# EAGLE board ME461_F28379D (EAGLE 7.7.0), part 1 of 3
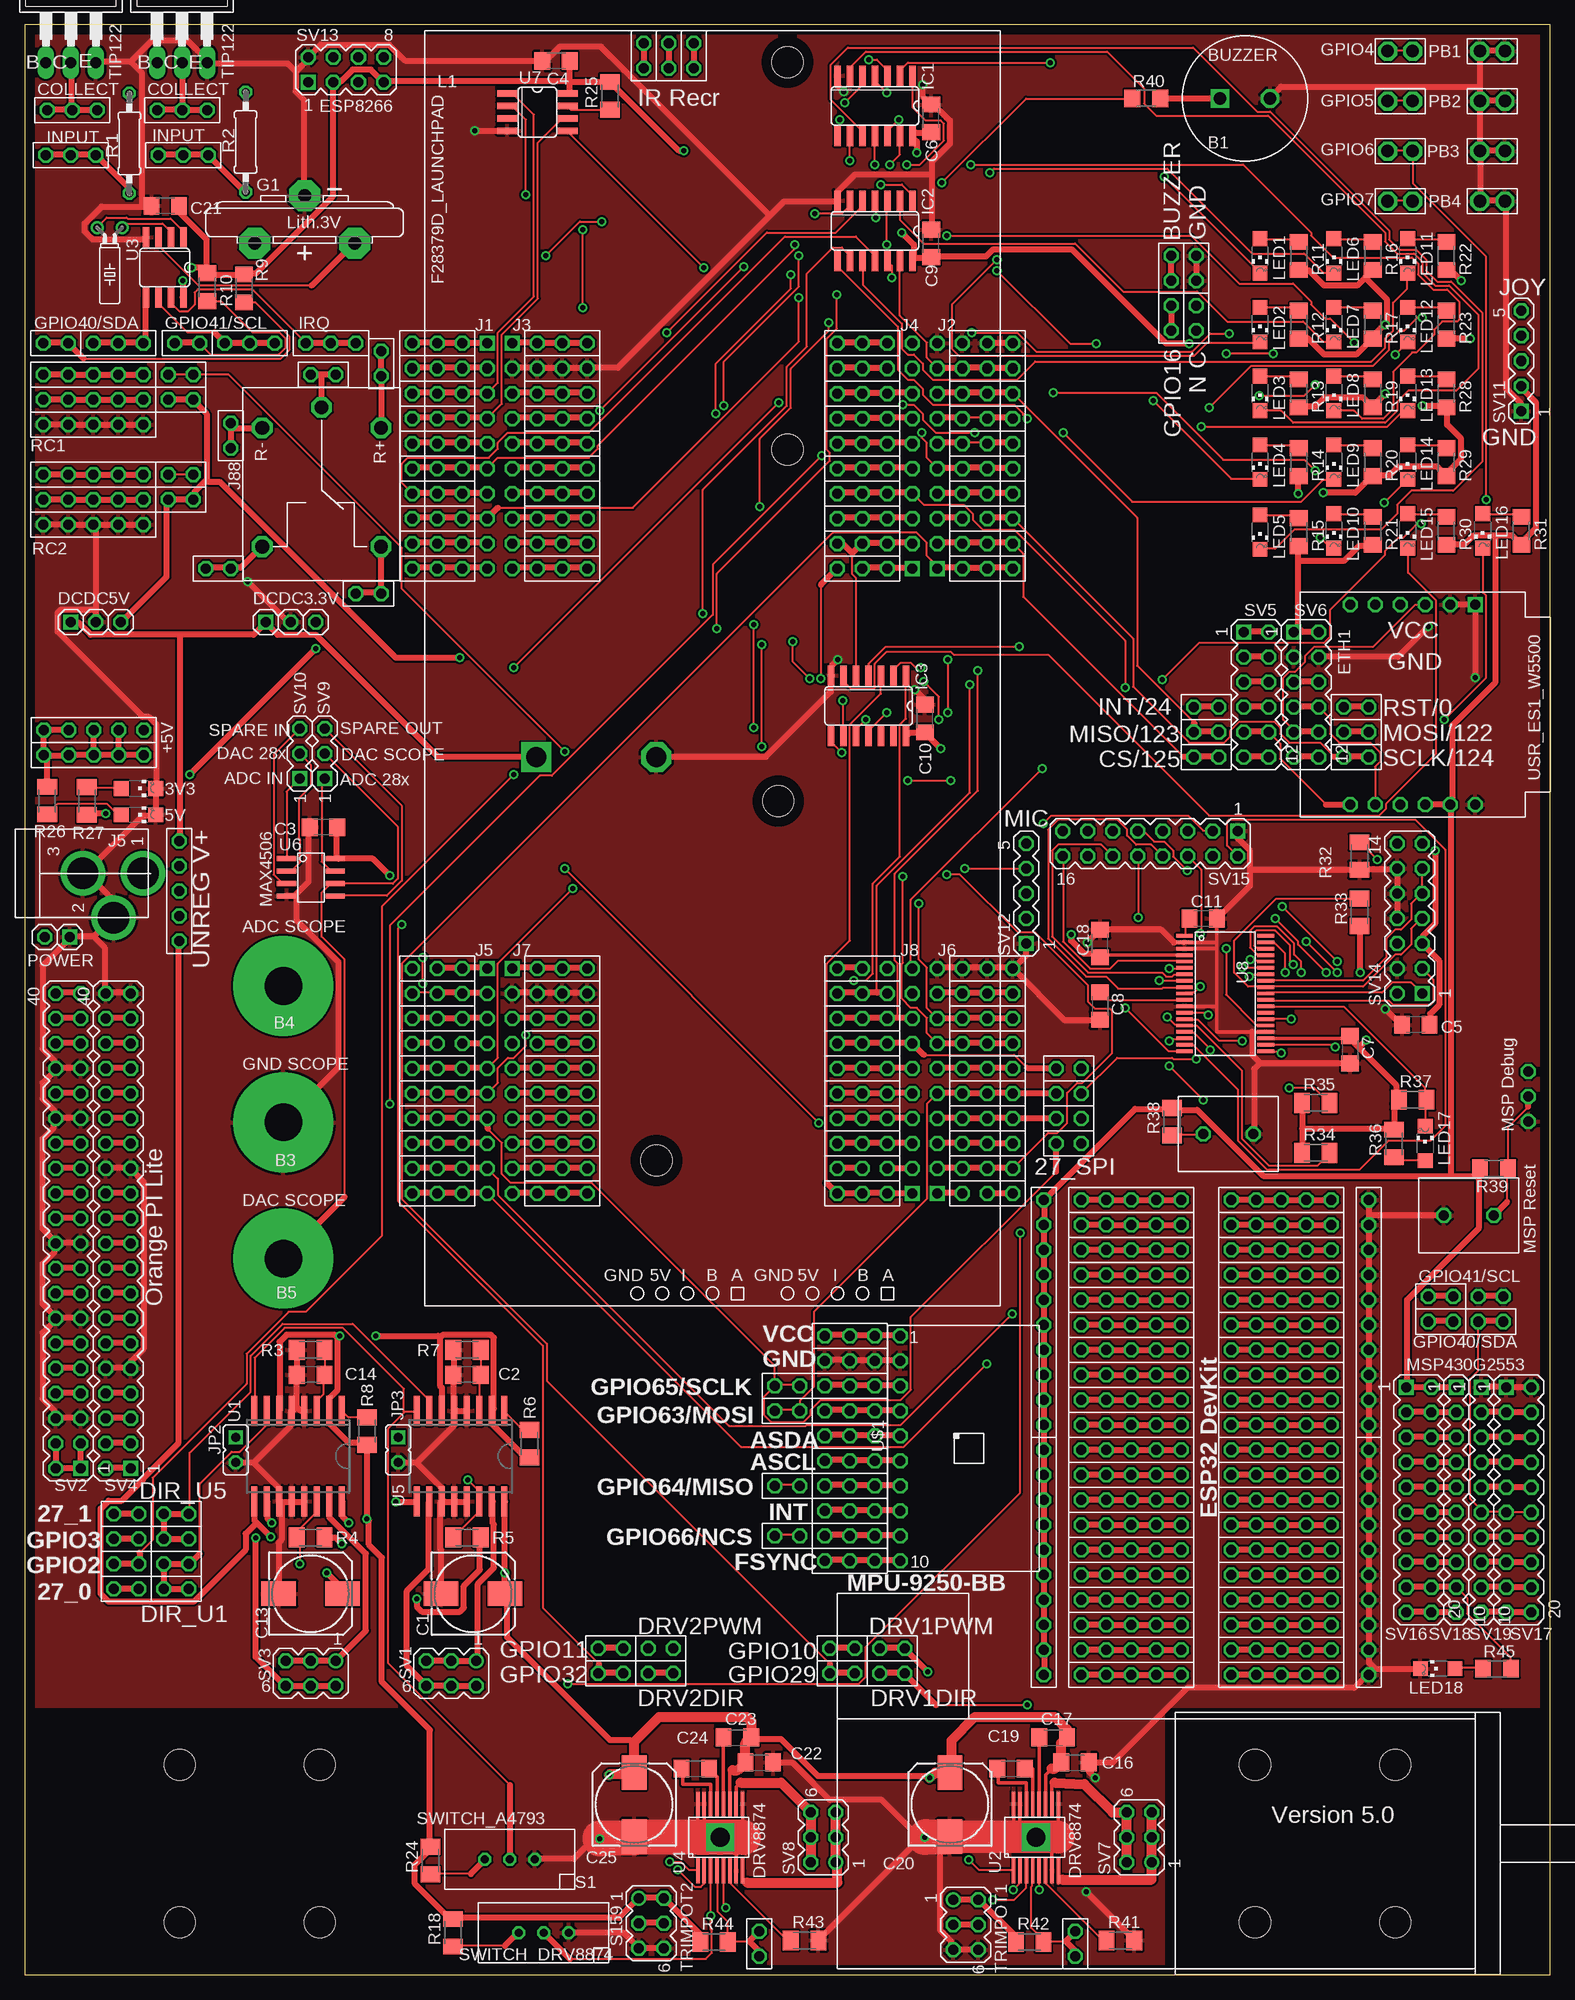
[diagram p5: board, top side]
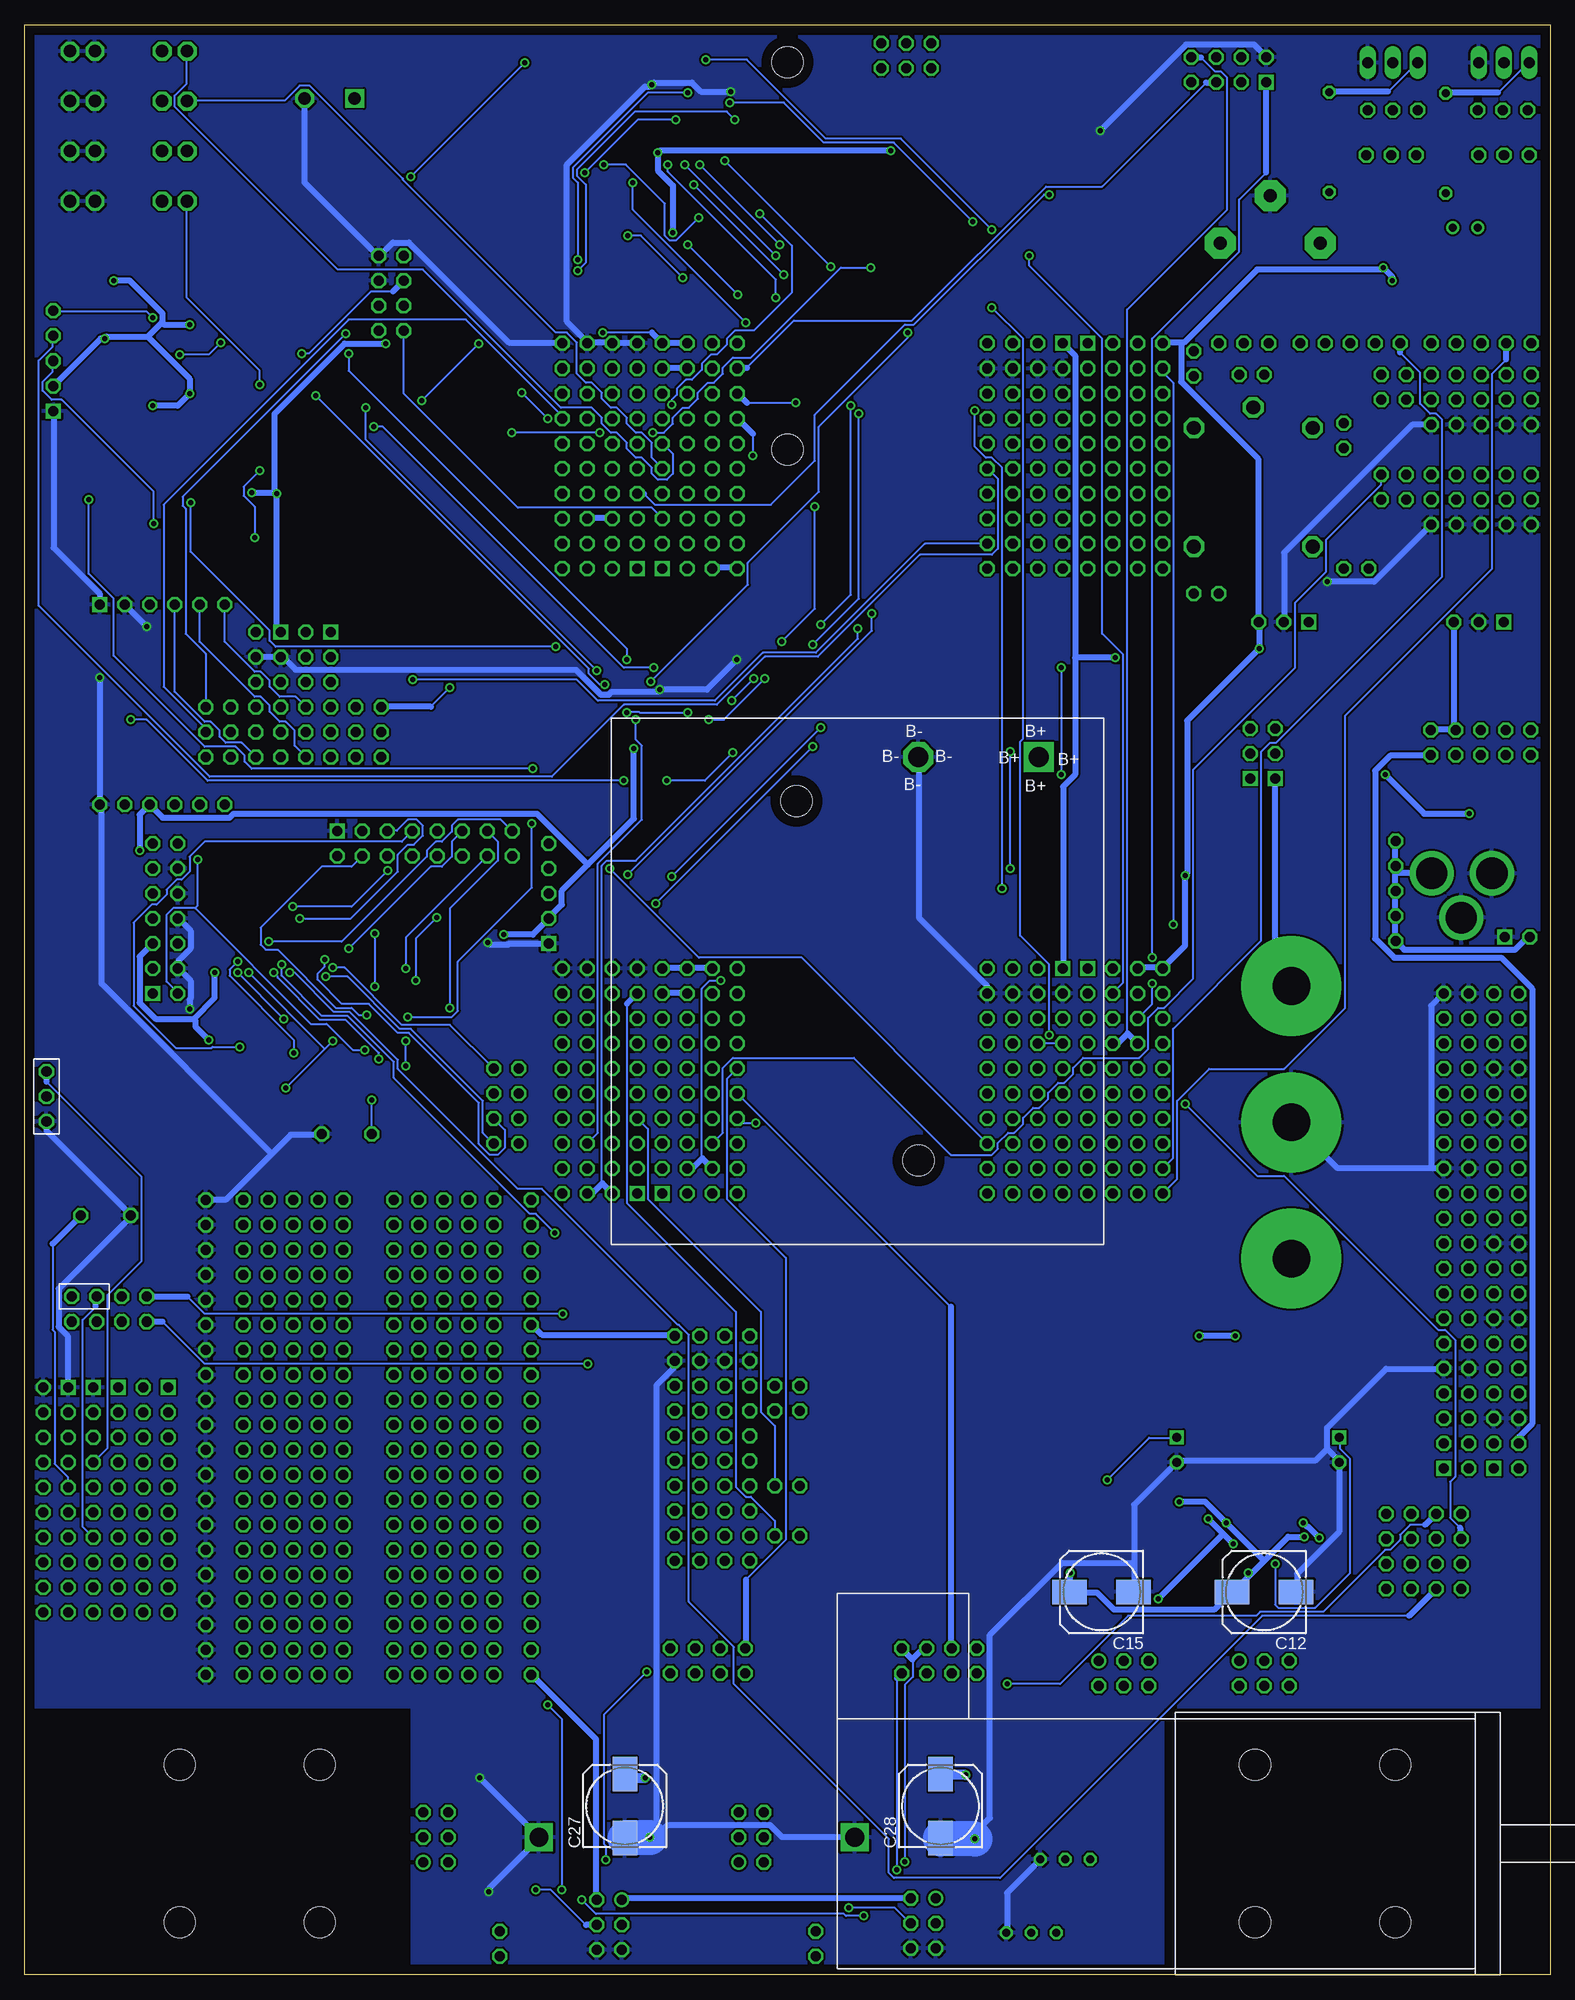
[diagram p6: board, bottom side, seen from below]

Size 154.94 x 198.12 mm. Coordinates in mm from the lower left corner, seen from the top.
Outline: 0,0 154.94,0 154.94,198.12 0,198.12 0,0
Copper layers (1*16): Top 0.035mm / dielectric 1.5mm / Bottom 0.035mm
Design rules "default *": minimum track width 7mil, minimum drill 20mil, track to track 8mil, track to pad 8mil, pad to pad 8mil, via to via 8mil, smd to smd 8mil, copper to edge 40mil, drill to drill 8mil, minimum pad ring 10mil, minimum via ring 8mil, stop-mask expansion 4mil, vias tented up to drill 20mil, thermal gap 10mil
Net classes: 0 default: width 0.203 mm, drill 0.508 mm, clearance 0.203 mm; 1 supply: width 0.61 mm, drill 0.508 mm, clearance 0.203 mm
tRestrict: area 0,0 to 38.7,26.7; area 116.2,0 to 154.9,26.7
bRestrict: area 116.2,0 to 154.9,26.7; area 0,0 to 38.7,26.7

## Footprints (pad centres in the part's own frame; a part is rotated, then mirrored left to right if it is on the bottom)
CHIPLED_1206 = smd 1.5 x 1.5: A 0,-1.75; C 0,1.75
BUZZER = drill 1.27 square: P$1 -2.54,0 | drill 1.27 octagon: P$2 2.54,0
BATTERY_4AA_HOLDER = drill 2.032 square: P$1 0,0 | drill 2.032 octagon: P$2 12.224,0 | hole 3.175: 12.224,40.958; 24.606,4.445
BANANA_MALE = drill 3.81 pad 10.16: P$1 0,0
153CLV-0810 = smd 3.5 x 2.5: + 3.25,0; - -3.25,0
C1206 = smd 1.6 x 1.8: 1 -1.4,0; 2 1.4,0
1X03 = drill 1.016 square: 1 -2.54,0 | drill 1.016 octagon: 2 0,0; 3 2.54,0
USR_ES1_W5500 = drill 1.016 square: P$1 0,0 | drill 1.016 octagon: P$2 0,-2.54; P$3 0,-5.08; P$4 0,-7.62; P$5 0,-10.16; P$6 0,-12.7; P$7 20.32,-12.7; P$8 20.32,-10.16; P$9 20.32,-7.62; P$10 20.32,-5.08; P$11 20.32,-2.54; P$12 20.32,0
CR2032V = drill 1.321 pad 3.15 octagon: + -2.54,-5.08; +@1 -2.54,5.08; - 2.286,0
SO14 = smd 0.66 x 2.032: 1 -3.81,-3.073; 2 -2.54,-3.073; 3 -1.27,-3.073; 4 0,-3.073; 5 1.27,-3.073; 6 2.54,-3.073; 7 3.81,-3.073; 8 3.81,3.073; 9 2.54,3.073; 10 1.27,3.073; 11 0,3.073; 12 -1.27,3.073; 13 -2.54,3.073; 14 -3.81,3.073
STRIP3 = drill 1.016 octagon: P$1 0,0; P$2 2.54,0; P$3 5.08,0
JACK-PMS = drill 3.175 pad 4.5: 1 -0.5,-3.31; 2 -5,-0.31; 3 -0.5,2.809
STRIP2 = drill 1.016 octagon: P$1 0,0; P$2 2.54,0
RELAY_JQC-3F_5V = drill 1.397 octagon: P$1 0,0; P$2 2.064,6.032; P$3 14.129,6.032; P$4 14.129,-6.032; P$5 2.064,-6.032
JP1 = drill 0.914 square: 1 0,-1.27 | drill 0.914 octagon: 2 0,1.27
F28379D_LAUNCHPAD = drill 1.016 square: P$1 -24.13,33.02; P$11 21.59,10.16; P$21 -21.59,33.02; P$31 19.05,10.16; P$41 -24.13,-30.48; P$51 21.59,-53.34; P$61 -21.59,-30.48; P$71 19.05,-53.34 | drill 1.016 octagon: P$2 -24.13,30.48; P$3 -24.13,27.94; P$4 -24.13,25.4; P$5 -24.13,22.86; P$6 -24.13,20.32; P$7 -24.13,17.78; P$8 -24.13,15.24; P$9 -24.13,12.7; P$10 -24.13,10.16; P$12 21.59,12.7; P$13 21.59,15.24; P$14 21.59,17.78; P$15 21.59,20.32; P$16 21.59,22.86; P$17 21.59,25.4; P$18 21.59,27.94; P$19 21.59,30.48; P$20 21.59,33.02; P$22 -21.59,30.48; P$23 -21.59,27.94; P$24 -21.59,25.4; P$25 -21.59,22.86; P$26 -21.59,20.32; P$27 -21.59,17.78; P$28 -21.59,15.24; P$29 -21.59,12.7; P$30 -21.59,10.16; P$32 19.05,12.7; P$33 19.05,15.24; P$34 19.05,17.78; P$35 19.05,20.32; P$36 19.05,22.86; P$37 19.05,25.4; P$38 19.05,27.94; P$39 19.05,30.48; P$40 19.05,33.02; P$42 -24.13,-33.02; P$43 -24.13,-35.56; P$44 -24.13,-38.1; P$45 -24.13,-40.64; P$46 -24.13,-43.18; P$47 -24.13,-45.72; P$48 -24.13,-48.26; P$49 -24.13,-50.8; P$50 -24.13,-53.34; P$52 21.59,-50.8; P$53 21.59,-48.26; P$54 21.59,-45.72; P$55 21.59,-43.18; P$56 21.59,-40.64; P$57 21.59,-38.1; P$58 21.59,-35.56; P$59 21.59,-33.02; P$60 21.59,-30.48; P$62 -21.59,-33.02; P$63 -21.59,-35.56; P$64 -21.59,-38.1; P$65 -21.59,-40.64; P$66 -21.59,-43.18; P$67 -21.59,-45.72; P$68 -21.59,-48.26; P$69 -21.59,-50.8; P$70 -21.59,-53.34; P$72 19.05,-50.8; P$73 19.05,-48.26; P$74 19.05,-45.72; P$75 19.05,-43.18; P$76 19.05,-40.64; P$77 19.05,-38.1; P$78 19.05,-35.56; P$79 19.05,-33.02; P$80 19.05,-30.48
TH_PUSHBUTTON = drill 1.016 octagon: 1 0,2.54; 2 0,-2.54
1X02 = drill 1.016 square: 1 -1.27,0 | drill 1.016 octagon: 2 1.27,0
TC26H = drill 0.813: 1 -1.27,0; 2 1.27,0
0207/10 = drill 0.813 octagon: 1 -5.08,0; 2 5.08,0
M1206 = smd 1.6 x 2: 1 -1.4,0; 2 1.4,0
R1206 = smd 1.6 x 1.803: 1 -1.422,0; 2 1.422,0
SWITCH_SLIDE = drill 0.813 octagon: P$1 0,-5.08; P$2 0,-2.54; P$3 0,0
STRIP5 = drill 1.016 octagon: P$1 0,0; P$2 2.54,0; P$3 5.08,0; P$4 7.62,0; P$5 10.16,0
STRIP10 = drill 1.016 octagon: P$1 0,0; P$2 2.54,0; P$3 5.08,0; P$4 7.62,0; P$5 10.16,0; P$6 12.7,0; P$7 15.24,0; P$8 17.78,0; P$9 20.32,0; P$10 22.86,0
MA03-2 = drill 1.016: 1 -2.54,-1.27 | drill 1.016 octagon: 2 -2.54,1.27; 3 0,-1.27; 4 0,1.27; 5 2.54,-1.27; 6 2.54,1.27
MA20-2 = drill 1.016 square: 1 -24.13,-1.27 | drill 1.016 octagon: 2 -24.13,1.27; 3 -21.59,-1.27; 4 -21.59,1.27; 5 -19.05,-1.27; 6 -19.05,1.27; 7 -16.51,-1.27; 8 -16.51,1.27; 9 -13.97,-1.27; 10 -13.97,1.27; 11 -11.43,-1.27; 12 -11.43,1.27; 13 -8.89,-1.27; 14 -8.89,1.27; 15 -6.35,-1.27; 16 -6.35,1.27; 17 -3.81,-1.27; 18 -3.81,1.27; 19 -1.27,-1.27; 20 -1.27,1.27; 21 1.27,-1.27; 22 1.27,1.27; 23 3.81,-1.27; 24 3.81,1.27; 25 6.35,-1.27; 26 6.35,1.27; 27 8.89,-1.27; 28 8.89,1.27; 29 11.43,-1.27; 30 11.43,1.27; 31 13.97,-1.27; 32 13.97,1.27; 33 16.51,-1.27; 34 16.51,1.27; 35 19.05,-1.27; 36 19.05,1.27; 37 21.59,-1.27; 38 21.59,1.27; 39 24.13,-1.27; 40 24.13,1.27
MA06-2 = drill 1.016 square: 1 -6.35,-1.27 | drill 1.016 octagon: 2 -6.35,1.27; 3 -3.81,-1.27; 4 -3.81,1.27; 5 -1.27,-1.27; 6 -1.27,1.27; 7 1.27,-1.27; 8 1.27,1.27; 9 3.81,-1.27; 10 3.81,1.27; 11 6.35,-1.27; 12 6.35,1.27
MA03-1 = drill 1.016 square: 1 -2.54,0 | drill 1.016 octagon: 2 0,0; 3 2.54,0
MA05-1 = drill 1.016 square: 1 -5.08,0 | drill 1.016 octagon: 2 -2.54,0; 3 0,0; 4 2.54,0; 5 5.08,0
MA04-2 = drill 1.016 square: 1 -3.81,-1.27 | drill 1.016 octagon: 2 -3.81,1.27; 3 -1.27,-1.27; 4 -1.27,1.27; 5 1.27,-1.27; 6 1.27,1.27; 7 3.81,-1.27; 8 3.81,1.27
MA07-2 = drill 1.016 square: 1 -7.62,-1.27 | drill 1.016 octagon: 2 -7.62,1.27; 3 -5.08,-1.27; 4 -5.08,1.27; 5 -2.54,-1.27; 6 -2.54,1.27; 7 0,-1.27; 8 0,1.27; 9 2.54,-1.27; 10 2.54,1.27; 11 5.08,-1.27; 12 5.08,1.27; 13 7.62,-1.27; 14 7.62,1.27
MA08-2 = drill 1.016 square: 1 -8.89,-1.27 | drill 1.016 octagon: 2 -8.89,1.27; 3 -6.35,-1.27; 4 -6.35,1.27; 5 -3.81,-1.27; 6 -3.81,1.27; 7 -1.27,-1.27; 8 -1.27,1.27; 9 1.27,-1.27; 10 1.27,1.27; 11 3.81,-1.27; 12 3.81,1.27; 13 6.35,-1.27; 14 6.35,1.27; 15 8.89,-1.27; 16 8.89,1.27
MA10-2 = drill 1.016 square: 1 -11.43,-1.27 | drill 1.016 octagon: 2 -11.43,1.27; 3 -8.89,-1.27; 4 -8.89,1.27; 5 -6.35,-1.27; 6 -6.35,1.27; 7 -3.81,-1.27; 8 -3.81,1.27; 9 -1.27,-1.27; 10 -1.27,1.27; 11 1.27,-1.27; 12 1.27,1.27; 13 3.81,-1.27; 14 3.81,1.27; 15 6.35,-1.27; 16 6.35,1.27; 17 8.89,-1.27; 18 8.89,1.27; 19 11.43,-1.27; 20 11.43,1.27
MA10-1 = drill 1.016 square: 1 -11.43,0 | drill 1.016 octagon: 2 -8.89,0; 3 -6.35,0; 4 -3.81,0; 5 -1.27,0; 6 1.27,0; 7 3.81,0; 8 6.35,0; 9 8.89,0; 10 11.43,0
TO220 = drill 1.118 long: 1 -2.54,-6.35; 2 0,-6.35; 3 2.54,-6.35
SO16W_LONGERPINS = smd 0.6 x 3.048: 1 -4.445,-4.6; 2 -3.175,-4.6; 3 -1.905,-4.6; 4 -0.635,-4.6; 5 0.635,-4.6; 6 1.905,-4.6; 7 3.175,-4.6; 8 4.445,-4.6; 9 4.445,4.6; 10 3.175,4.6; 11 1.905,4.6; 12 0.635,4.6; 13 -0.635,4.6; 14 -1.905,4.6; 15 -3.175,4.6; 16 -4.445,4.6
HTSSOP16 = smd 2.5 x 0.35: P$1 -3.4,2.275; P$2 -3.4,1.625; P$3 -3.4,0.975; P$4 -3.4,0.325; P$5 -3.4,-0.325; P$6 -3.4,-0.975; P$7 -3.4,-1.625; P$8 -3.4,-2.275; P$9 3.4,-2.275; P$10 3.4,-1.625; P$11 3.4,-0.975; P$12 3.4,-0.325; P$13 3.4,0.325; P$14 3.4,0.975; P$15 3.4,1.625; P$16 3.4,2.275 | drill 1.905 pad 2.54 square: P$17 0,0
SO08 = smd 0.66 x 2.032: 1 -1.905,-3.073; 2 -0.635,-3.073; 3 0.635,-3.073; 4 1.905,-3.073; 5 1.905,3.073; 6 0.635,3.073; 7 -0.635,3.073; 8 -1.905,3.073
SOIC-8 = smd 1.98 x 0.53: P$1 -2.465,1.905; P$2 -2.465,0.635; P$3 -2.465,-0.635; P$4 -2.465,-1.905; P$5 2.465,-1.905; P$6 2.465,-0.635; P$7 2.465,0.635; P$8 2.465,1.905
DA38 = smd 0.35 x 1.705: 1 -5.85,-4.12; 2 -5.2,-4.12; 3 -4.55,-4.12; 4 -3.9,-4.12; 5 -3.25,-4.12; 6 -2.6,-4.12; 7 -1.95,-4.12; 8 -1.3,-4.12; 9 -0.65,-4.12; 10 0,-4.12; 11 0.65,-4.12; 12 1.3,-4.12; 13 1.95,-4.12; 14 2.6,-4.12; 15 3.25,-4.12; 16 3.9,-4.12; 17 4.55,-4.12; 18 5.2,-4.12; 19 5.85,-4.12; 20 5.85,4.12; 21 5.2,4.12; 22 4.55,4.12; 23 3.9,4.12; 24 3.25,4.12; 25 2.6,4.12; 26 1.95,4.12; 27 1.3,4.12; 28 0.65,4.12; 29 0,4.12; 30 -0.65,4.12; 31 -1.3,4.12; 32 -1.95,4.12; 33 -2.6,4.12; 34 -3.25,4.12; 35 -3.9,4.12; 36 -4.55,4.12; 37 -5.2,4.12; 38 -5.85,4.12
MPU-9250-BB = drill 1.016 octagon: 1 -11.434,-6.96; 2 -8.894,-6.96; 3 -6.354,-6.96; 4 -3.814,-6.96; 5 -1.274,-6.96; 6 1.266,-6.96; 7 3.806,-6.96; 8 6.346,-6.96; 9 8.886,-6.96; 10 11.426,-6.96
GEARMOTOR_MOUNT = hole 3.175: 7.112,8.001; -7.112,8.001; -7.112,-8.001; 7.112,-8.001
CASTERWHEEL = hole 3.175: 19.685,0; -19.685,0
2PIN50MIL = drill 1.27 octagon: P$1 0,0; P$2 2.54,0

## Placement (x,y rotation side)
3V3  [CHIPLED_1206]  11.56,120.52 270 top
5V  [CHIPLED_1206]  11.56,117.86 270 top
B1  BUZZER  [BUZZER]  123.95,190.63 0 top
B2  BATTERY_4AA_HOLDER  [BATTERY_4AA_HOLDER]  51.94,123.7 180 bottom
B3  GND SCOPE  [BANANA_MALE]  26.29,86.61 0 top
B4  ADC SCOPE  [BANANA_MALE]  26.29,100.46 0 top
B5  DAC SCOPE  [BANANA_MALE]  26.29,72.77 0 top
C1  47uF  [153CLV-0810]  45.56,38.73 0 top
C2  680pF  [C1206]  44.92,60.95 180 top
C3  0.1uf  [C1206]  30.35,116.59 180 top
C4  0.1uf  [C1206]  53.98,194.44 180 top
C5  0.1 uF  [C1206]  141.29,96.52 180 top
C6  0.1uf  [C1206]  92.08,188.59 90 top
C7  2.2 uF  [C1206]  134.62,93.98 270 top
C8  2.2 uF  [C1206]  109.22,98.42 270 top
C9  0.1uf  [C1206]  92.08,175.9 90 top
C10  0.1uf  [C1206]  91.44,127.64 90 top
C11  2.2 uF  [C1206]  119.7,107.31 0 top
C12  47uF  [153CLV-0810]  29.05,38.89 180 bottom
C13  47uF  [153CLV-0810]  29.05,38.73 0 top
C14  680pF  [C1206]  29.05,60.95 180 top
C15  47uF  [153CLV-0810]  45.56,38.89 180 bottom
C16  0.1uF  [C1206]  106.68,21.59 0 top
C17  0.1uF  [C1206]  104.46,24.13 0 top
C18  2.2 uF  [C1206]  109.22,104.78 90 top
C19  22nF  [C1206]  100.17,20.95 0 top
C20  47uF  [153CLV-0810]  93.98,17.3 90 top
C21  0.1uf  [C1206]  14.29,179.71 180 top
C22  0.1uF  [C1206]  74.61,21.59 0 top
C23  0.1uF  [C1206]  72.39,24.13 0 top
C24  22nF  [C1206]  68.1,20.95 0 top
C25  47uF  [153CLV-0810]  61.91,17.3 90 top
C27  47uF  [153CLV-0810]  93.98,17.14 90 bottom
C28  47uF  [153CLV-0810]  61.91,17.14 90 bottom
DCDC3.3V  [1X03]  27.05,137.41 0 top
DCDC5V  [1X03]  7.24,137.41 0 top
ETH1  USR_ES1_W5500  [USR_ES1_W5500]  147.32,139.19 270 top
G1  CR2032V  [CR2032V]  28.44,178.46 90 top
IC1  7404D  [SO14]  86.36,189.87 180 top
IC2  7404D  [SO14]  86.36,177.16 180 top
IC3  7404D  [SO14]  85.72,128.91 180 top
J1  STRIP3  [STRIP3]  28.57,165.74 0 top
J2  STRIP3  [STRIP3]  20.32,165.74 0 top
J3  STRIP3  [STRIP3]  6.99,165.74 0 top
J4  STRIP3  [STRIP3]  2.28,189.45 0 top
J5  [JACK-PMS]  8.72,112.4 90 top
J6  STRIP3  [STRIP3]  2.15,184.87 0 top
J7  STRIP2  [STRIP2]  119,172.09 90 top
J8  STRIP2  [STRIP2]  119,167 90 top
J9  STRIP2  [STRIP2]  118.75,128.78 0 top
J10  STRIP3  [STRIP3]  39.37,165.74 0 top
J11  STRIP2  [STRIP2]  133.99,128.78 0 top
J12  STRIP2  [STRIP2]  62.87,193.68 90 top
J13  STRIP2  [STRIP2]  65.41,193.68 90 top
J14  STRIP3  [STRIP3]  39.37,163.19 0 top
J15  STRIP3  [STRIP3]  39.37,160.66 0 top
J16  STRIP3  [STRIP3]  39.37,158.12 0 top
J17  STRIP3  [STRIP3]  39.37,155.57 0 top
J18  STRIP3  [STRIP3]  39.37,153.03 0 top
J19  STRIP3  [STRIP3]  39.37,150.5 0 top
J20  STRIP3  [STRIP3]  39.37,147.96 0 top
J21  STRIP3  [STRIP3]  39.37,145.41 0 top
J22  STRIP2  [STRIP2]  67.94,193.68 90 top
J23  STRIP3  [STRIP3]  13.46,189.45 0 top
J24  STRIP3  [STRIP3]  13.58,184.87 0 top
J25  STRIP2  [STRIP2]  14.13,39.21 0 top
J26  STRIP2  [STRIP2]  9.05,39.21 0 top
J27  STRIP2  [STRIP2]  9.05,46.83 0 top
J28  STRIP3  [STRIP3]  39.37,142.88 0 top
J29  STRIP3  [STRIP3]  95.25,142.88 0 top
J30  STRIP3  [STRIP3]  95.25,145.41 0 top
J31  STRIP3  [STRIP3]  95.25,147.96 0 top
J32  STRIP3  [STRIP3]  95.25,150.5 0 top
J33  STRIP3  [STRIP3]  95.25,153.03 0 top
J34  STRIP2  [STRIP2]  14.13,46.83 0 top
J35  STRIP2  [STRIP2]  107.31,87 180 top
J36  STRIP2  [STRIP2]  107.31,89.53 180 top
J37  STRIP2  [STRIP2]  107.31,92.08 180 top
J38  STRIP2  [STRIP2]  107.31,84.45 180 top
J39  STRIP2  [STRIP2]  150.18,68.9 0 bottom
J40  STRIP2  [STRIP2]  142.56,68.9 0 top
J41  STRIP2  [STRIP2]  147.64,66.36 0 top
J42  STRIP2  [STRIP2]  142.56,66.36 0 top
J43  STRIP3  [STRIP3]  152.72,86.68 90 bottom
J66  STRIP2  [STRIP2]  133.99,126.24 0 top
J67  STRIP2  [STRIP2]  118.75,126.24 0 top
J68  STRIP2  [STRIP2]  133.99,123.7 0 top
J69  STRIP2  [STRIP2]  118.75,123.7 0 top
J78  STRIP2  [STRIP2]  106.68,4.45 270 top
J79  STRIP2  [STRIP2]  86.84,33.18 0 top
J80  STRIP2  [STRIP2]  86.84,30.64 0 top
J81  STRIP2  [STRIP2]  74.61,4.45 270 top
J82  STRIP2  [STRIP2]  63.34,33.18 0 top
J83  STRIP2  [STRIP2]  63.34,30.64 0 top
J84  STRIP2  [STRIP2]  81.76,33.18 0 top
J85  STRIP2  [STRIP2]  81.76,30.64 0 top
J86  STRIP2  [STRIP2]  58.26,33.18 0 top
J87  STRIP2  [STRIP2]  58.26,30.64 0 top
J88  RELAY_JQC-3F_5V  [RELAY_JQC-3F_5V]  30.16,159.23 270 top
J89  STRIP2  [STRIP2]  36.2,164.94 270 top
J90  STRIP2  [STRIP2]  20.95,157.64 270 top
J91  STRIP2  [STRIP2]  29.05,162.56 0 top
J92  STRIP2  [STRIP2]  33.66,140.34 0 top
J93  STRIP2  [STRIP2]  18.41,142.88 0 top
J98  STRIP3  [STRIP3]  95.25,155.57 0 top
J99  STRIP3  [STRIP3]  95.25,158.12 0 top
J100  STRIP3  [STRIP3]  95.25,160.66 0 top
J101  STRIP3  [STRIP3]  95.25,163.19 0 top
J102  STRIP3  [STRIP3]  95.25,165.74 0 top
J103  STRIP3  [STRIP3]  52.07,165.74 0 top
J104  STRIP3  [STRIP3]  52.07,163.19 0 top
J105  STRIP3  [STRIP3]  52.07,160.66 0 top
J106  STRIP3  [STRIP3]  52.07,158.12 0 top
J107  STRIP3  [STRIP3]  52.07,155.57 0 top
J108  STRIP3  [STRIP3]  52.07,153.03 0 top
J109  STRIP3  [STRIP3]  52.07,150.5 0 top
J110  STRIP3  [STRIP3]  52.07,147.96 0 top
J111  STRIP3  [STRIP3]  52.07,145.41 0 top
J112  STRIP3  [STRIP3]  52.07,142.88 0 top
J113  STRIP3  [STRIP3]  82.55,142.88 0 top
J114  STRIP3  [STRIP3]  82.55,145.41 0 top
J115  STRIP3  [STRIP3]  82.55,147.96 0 top
J116  STRIP3  [STRIP3]  82.55,150.5 0 top
J117  STRIP3  [STRIP3]  82.55,153.03 0 top
J118  STRIP3  [STRIP3]  82.55,155.57 0 top
J119  STRIP3  [STRIP3]  82.55,158.12 0 top
J120  STRIP3  [STRIP3]  82.55,160.66 0 top
J121  STRIP3  [STRIP3]  82.55,163.19 0 top
J122  STRIP3  [STRIP3]  82.55,165.74 0 top
J123  STRIP3  [STRIP3]  81.28,64.93 0 top
J124  STRIP3  [STRIP3]  81.28,62.39 0 top
J125  STRIP3  [STRIP3]  81.28,59.85 0 top
J126  STRIP3  [STRIP3]  81.28,57.31 0 top
J127  STRIP3  [STRIP3]  81.28,54.77 0 top
J128  STRIP3  [STRIP3]  81.28,52.23 0 top
J129  STRIP3  [STRIP3]  81.28,49.69 0 top
J130  STRIP3  [STRIP3]  81.28,47.15 0 top
J131  STRIP3  [STRIP3]  81.28,44.61 0 top
J132  STRIP3  [STRIP3]  81.28,42.07 0 top
J133  STRIP3  [STRIP3]  82.55,102.23 0 top
J134  STRIP3  [STRIP3]  82.55,99.69 0 top
J135  STRIP3  [STRIP3]  82.55,97.16 0 top
J136  STRIP3  [STRIP3]  82.55,94.61 0 top
J137  STRIP3  [STRIP3]  82.55,92.08 0 top
J138  STRIP3  [STRIP3]  82.55,89.53 0 top
J139  STRIP3  [STRIP3]  82.55,87 0 top
J140  STRIP3  [STRIP3]  82.55,84.45 0 top
J141  STRIP3  [STRIP3]  82.55,81.92 0 top
J142  STRIP3  [STRIP3]  82.55,79.38 0 top
J143  STRIP3  [STRIP3]  52.07,79.38 0 top
J144  STRIP3  [STRIP3]  52.07,81.92 0 top
J145  STRIP3  [STRIP3]  52.07,84.45 0 top
J146  STRIP3  [STRIP3]  52.07,87 0 top
J147  STRIP3  [STRIP3]  52.07,89.53 0 top
J148  STRIP3  [STRIP3]  52.07,92.08 0 top
J149  STRIP3  [STRIP3]  52.07,94.61 0 top
J150  STRIP3  [STRIP3]  52.07,97.16 0 top
J151  STRIP3  [STRIP3]  52.07,99.69 0 top
J152  STRIP3  [STRIP3]  52.07,102.23 0 top
J153  STRIP3  [STRIP3]  95.25,102.23 0 top
J154  STRIP3  [STRIP3]  95.25,99.69 0 top
J155  STRIP3  [STRIP3]  95.25,97.16 0 top
J156  STRIP3  [STRIP3]  95.25,94.61 0 top
J157  STRIP3  [STRIP3]  95.25,92.08 0 top
J158  STRIP3  [STRIP3]  95.25,89.53 0 top
J159  STRIP3  [STRIP3]  95.25,87 0 top
J160  STRIP3  [STRIP3]  95.25,84.45 0 top
J161  STRIP3  [STRIP3]  95.25,81.92 0 top
J162  STRIP3  [STRIP3]  95.25,79.38 0 top
J163  STRIP3  [STRIP3]  39.37,79.38 0 top
J164  STRIP3  [STRIP3]  39.37,81.92 0 top
J165  STRIP3  [STRIP3]  39.37,84.45 0 top
J166  STRIP3  [STRIP3]  39.37,87 0 top
J167  STRIP3  [STRIP3]  39.37,89.53 0 top
J168  STRIP3  [STRIP3]  39.37,92.08 0 top
J169  STRIP3  [STRIP3]  39.37,94.61 0 top
J170  STRIP3  [STRIP3]  39.37,97.16 0 top
J176  STRIP3  [STRIP3]  39.37,99.69 0 top
J177  STRIP3  [STRIP3]  39.37,102.23 0 top
J194  STRIP2  [STRIP2]  116.46,172.09 90 top
J196  STRIP2  [STRIP2]  14.13,41.75 0 top
J197  STRIP2  [STRIP2]  14.13,44.29 0 top
J198  STRIP2  [STRIP2]  9.05,41.75 0 top
J199  STRIP2  [STRIP2]  9.05,44.29 0 top
J200  STRIP2  [STRIP2]  14.61,160.02 0 top
J201  STRIP2  [STRIP2]  14.61,162.56 0 top
J202  STRIP2  [STRIP2]  14.61,152.4 0 top
J203  STRIP2  [STRIP2]  14.61,149.86 0 top
J204  STRIP2  [STRIP2]  76.2,57.31 0 top
J205  STRIP2  [STRIP2]  76.2,49.69 0 top
J206  STRIP2  [STRIP2]  76.2,59.85 0 top
J207  STRIP2  [STRIP2]  76.2,44.61 0 top
J208  STRIP2  [STRIP2]  1.91,165.74 0 top
J209  STRIP2  [STRIP2]  15.24,165.74 0 top
J251  STRIP2  [STRIP2]  116.46,167 90 top
JP2  [JP1]  21.43,53.33 180 top
JP3  [JP1]  37.94,53.33 180 top
L1  F28379D_LAUNCHPAD  [F28379D_LAUNCHPAD]  71.12,132.72 0 top
LED1  [CHIPLED_1206]  125.48,174.62 180 top
LED2  [CHIPLED_1206]  125.48,167.64 180 top
LED3  [CHIPLED_1206]  125.48,160.66 180 top
LED4  [CHIPLED_1206]  125.48,153.67 180 top
LED5  [CHIPLED_1206]  125.48,146.56 180 top
LED6  [CHIPLED_1206]  132.97,174.62 180 top
LED7  [CHIPLED_1206]  132.97,167.64 180 top
LED8  [CHIPLED_1206]  132.97,160.66 180 top
LED9  [CHIPLED_1206]  132.97,153.67 180 top
LED10  [CHIPLED_1206]  132.97,146.69 180 top
LED11  [CHIPLED_1206]  140.46,174.62 180 top
LED12  [CHIPLED_1206]  140.46,167.64 180 top
LED13  [CHIPLED_1206]  140.46,160.66 180 top
LED14  [CHIPLED_1206]  140.46,153.67 180 top
LED15  [CHIPLED_1206]  140.46,146.69 180 top
LED16  [CHIPLED_1206]  148.08,146.69 180 top
LED17  [CHIPLED_1206]  142.24,84.45 0 top
LED18  [CHIPLED_1206]  143.51,31.11 90 top
P1  [TH_PUSHBUTTON]  122.24,85.41 90 top
P2  [TH_PUSHBUTTON]  146.69,77.15 270 top
POWER  [1X02]  3.33,105.42 180 top
Q1  32.768KHz  [TC26H]  8.63,177.51 180 top
R1  R_B  [0207/10]  10.63,186.06 90 top
R2  R_B  [0207/10]  22.44,186.19 90 top
R3  24.9K  [M1206]  29.05,63.49 0 top
R4  2.2K  [M1206]  29.05,44.44 0 top
R5  2.2K  [M1206]  44.92,44.44 0 top
R6  2.2K  [M1206]  51.27,53.97 270 top
R7  24.9K  [M1206]  44.92,63.49 0 top
R8  2.2K  [M1206]  34.76,55.24 270 top
R9  4.7K  [R1206]  22.29,171.32 270 top
R10  4.7K  [R1206]  18.54,171.45 270 top
R11  [R1206]  129.41,174.62 270 top
R12  [R1206]  129.41,167.64 270 top
R13  [R1206]  129.41,160.66 270 top
R14  [R1206]  129.41,153.67 270 top
R15  [R1206]  129.41,146.56 270 top
R16  [R1206]  136.91,174.62 270 top
R17  [R1206]  136.91,167.64 270 top
R18  2.2K  [M1206]  43.49,4.28 90 top
R19  [R1206]  136.91,160.66 270 top
R20  [R1206]  136.91,153.67 270 top
R21  [R1206]  136.91,146.69 270 top
R22  [R1206]  144.4,174.62 270 top
R23  [R1206]  144.4,167.64 270 top
R24  2.2K  [M1206]  41.21,11.62 90 top
R25  10K  [M1206]  59.44,190.88 90 top
R26  1K  [M1206]  2.29,119.29 90 top
R27  1K  [M1206]  6.31,119.26 270 top
R28  [R1206]  144.4,160.66 270 top
R29  [R1206]  144.4,153.67 270 top
R30  [R1206]  144.4,146.69 270 top
R31  [R1206]  152.02,146.69 270 top
R32  4.7K  [M1206]  135.57,113.67 270 top
R33  4.7K  [M1206]  135.57,107.95 90 top
R34  4.7k  [M1206]  131.13,83.5 0 top
R35  4.7k  [M1206]  131.13,88.58 0 top
R36  1K  [M1206]  139.06,84.45 90 top
R37  4.7k  [M1206]  140.97,88.9 180 top
R38  4.7k  [M1206]  116.52,86.68 90 top
R39  10K  [R1206]  149.22,81.92 180 top
R40  100  [R1206]  113.92,190.63 0 top
R41  1.8K  [M1206]  111.28,3.49 0 top
R42  10K  [M1206]  102.08,3.33 0 top
R43  1.8K  [M1206]  79.22,3.49 0 top
R44  10K  [M1206]  70.01,3.33 0 top
R45  1K  [R1206]  149.54,31.11 0 top
S1  SWITCH_A4793  [SWITCH_SLIDE]  46.74,11.75 90 top
S17  STRIP5  [STRIP5]  12.12,123.91 180 top
S18  STRIP5  [STRIP5]  12.12,126.45 180 top
S20  STRIP10  [STRIP10]  136.53,30.48 90 top
S24  STRIP10  [STRIP10]  136.53,55.88 90 top
S53  STRIP10  [STRIP10]  103.5,30.48 90 top
S58  STRIP10  [STRIP10]  103.5,55.88 90 top
S129  STRIP5  [STRIP5]  12.06,157.48 180 top
S130  STRIP5  [STRIP5]  12.06,162.56 180 top
S137  STRIP5  [STRIP5]  12.06,147.32 180 top
S138  STRIP5  [STRIP5]  12.06,152.4 180 top
S139  STRIP5  [STRIP5]  12.06,149.86 180 top
S141  STRIP5  [STRIP5]  15.71,105.03 90 top
S147  STRIP5  [STRIP5]  12.06,160.02 180 top
S159  SWITCH_DRV8874  [SWITCH_SLIDE]  50.16,4.28 90 top
S167  STRIP5  [STRIP5]  107.31,78.74 0 top
S168  STRIP5  [STRIP5]  107.31,76.2 0 top
S169  STRIP5  [STRIP5]  107.31,73.66 0 top
S170  STRIP5  [STRIP5]  107.31,71.12 0 top
S171  STRIP5  [STRIP5]  107.31,68.58 0 top
S172  STRIP5  [STRIP5]  107.31,66.04 0 top
S173  STRIP5  [STRIP5]  107.31,63.5 0 top
S174  STRIP5  [STRIP5]  107.31,60.96 0 top
S175  STRIP5  [STRIP5]  107.31,58.42 0 top
S176  STRIP5  [STRIP5]  107.31,55.88 0 top
S177  STRIP5  [STRIP5]  107.31,53.34 0 top
S178  STRIP5  [STRIP5]  107.31,50.8 0 top
S179  STRIP5  [STRIP5]  107.31,48.26 0 top
S180  STRIP5  [STRIP5]  107.31,45.72 0 top
S181  STRIP5  [STRIP5]  107.31,43.18 0 top
S182  STRIP5  [STRIP5]  107.31,40.64 0 top
S183  STRIP5  [STRIP5]  107.31,38.1 0 top
S184  STRIP5  [STRIP5]  107.31,35.56 0 top
S185  STRIP5  [STRIP5]  107.31,33.02 0 top
S186  STRIP5  [STRIP5]  107.31,30.48 0 top
S187  STRIP5  [STRIP5]  122.56,30.48 0 top
S188  STRIP5  [STRIP5]  122.56,35.56 0 top
S189  STRIP5  [STRIP5]  122.56,33.02 0 top
S210  STRIP5  [STRIP5]  122.56,78.74 0 top
S211  STRIP5  [STRIP5]  122.56,76.2 0 top
S212  STRIP5  [STRIP5]  122.56,73.66 0 top
S213  STRIP5  [STRIP5]  122.56,71.12 0 top
S214  STRIP5  [STRIP5]  122.56,68.58 0 top
S215  STRIP5  [STRIP5]  122.56,66.04 0 top
S216  STRIP5  [STRIP5]  122.56,63.5 0 top
S217  STRIP5  [STRIP5]  122.56,60.96 0 top
S218  STRIP5  [STRIP5]  122.56,58.42 0 top
S219  STRIP5  [STRIP5]  122.56,55.88 0 top
S220  STRIP5  [STRIP5]  122.56,53.34 0 top
S221  STRIP5  [STRIP5]  122.56,50.8 0 top
S222  STRIP5  [STRIP5]  122.56,48.26 0 top
S223  STRIP5  [STRIP5]  122.56,45.72 0 top
S224  STRIP5  [STRIP5]  122.56,43.18 0 top
S225  STRIP5  [STRIP5]  122.56,40.64 0 top
S226  STRIP5  [STRIP5]  122.56,38.1 0 top
SV1  [MA03-2]  43.33,30.63 180 top
SV2  [MA20-2]  4.45,75.56 90 top
SV3  [MA03-2]  29.05,30.63 180 top
SV4  [MA20-2]  9.53,75.56 90 top
SV5  [MA06-2]  125.09,130.05 270 top
SV6  [MA06-2]  130.18,130.05 270 top
SV7  [MA03-2]  113.19,13.97 90 top
SV8  [MA03-2]  81.12,13.97 90 top
SV9  [MA03-1]  30.48,124.08 90 top
SV10  [MA03-1]  27.94,124.08 90 top
SV11  [MA05-1]  152.02,163.96 90 top
SV12  [MA05-1]  101.73,109.86 90 top
SV13  [MA04-2]  32.64,193.55 0 top
SV14  [MA07-2]  140.65,107.31 90 top
SV15  [MA08-2]  114.3,114.94 180 top
SV16  [MA10-2]  141.6,48.26 270 top
SV17  [MA10-2]  151.76,48.26 270 top
SV18  [MA10-1]  145.41,48.26 270 top
SV19  [MA10-1]  147.96,48.26 270 top
T1  TIP125  [TO220]  4.69,200.62 0 top
T2  TIP125  [TO220]  16,200.62 0 top
TRIMPOT1  [MA03-2]  95.57,5.08 270 top
TRIMPOT2  [MA03-2]  63.66,5.24 270 top
U1  A4973  [SO16W_LONGERPINS]  27.78,52.7 180 top
U2  DRV8874  [HTSSOP16]  102.71,13.97 90 top
U3  BQ32000  [SO08]  14.22,173.44 180 top
U4  DRV8874  [HTSSOP16]  70.64,13.97 90 top
U5  A4973  [SO16W_LONGERPINS]  44.29,52.7 180 top
U6  MAX4506  [SOIC-8]  29.08,111.51 0 top
U7  IS62WVS512  [SO08]  52.07,189.23 270 top
U8  F28027  [DA38]  121.92,99.69 270 top
U$1  MPU-9250-BB  [MPU-9250-BB]  95.89,53.5 270 top
U$2  GEARMOTOR_MOUNT  [GEARMOTOR_MOUNT]  132.08,13.34 0 top
U$3  GEARMOTOR_MOUNT  [GEARMOTOR_MOUNT]  22.86,13.34 0 bottom
U$4  CASTERWHEEL  [CASTERWHEEL]  77.47,174.62 90 top
U$5  [2PIN50MIL]  138.43,195.42 0 top
U$6  [2PIN50MIL]  147.8,195.42 0 top
U$7  [2PIN50MIL]  147.8,190.34 0 top
U$8  [2PIN50MIL]  147.8,185.26 0 top
U$9  [2PIN50MIL]  147.8,180.18 0 top
U$10  [2PIN50MIL]  138.43,190.34 0 top
U$11  [2PIN50MIL]  138.43,185.26 0 top
U$12  [2PIN50MIL]  138.43,180.18 0 top

## Tracks (layer width: path | path; a pad name or v marks a point on that pad's centre or on a via)
28027_GPIO0  (via drill 0.51)
  Top 0.203: v128.02,101.8 128.02,103.73 126.9,104.85 126.09,104.85 U8.37 | 9.14,39.22 J26.P$1 | J26.P$2
  Top 0.61: J26.P$2 9.14,39.22
  Bottom 0.203: v128.02,101.8 127.51,101.8 123.55,97.84 121.92,97.84 117.04,92.96 117.04,92.05 104.85,79.86 102.41,79.86 88.59,66.04 88.49,66.04 87.48,65.02 87.48,37.9 82.91,33.33 82.91,29.57 67.16,13.82 67.16,10.36 66.65,9.86 55.88,9.86 29.26,36.47 14.33,36.47
  Bottom 0.61: J26.P$2 14.33,36.47
28027_GPIO1  (via drill 0.51)
  Top 0.203: v128.83,102.62 128.52,102.92 128.52,104.55 127,106.07 125.07,106.07 124.87,105.87 124.87,104.55 125.07,104.34 125.98,104.34 U8.36 | v101.09,75.39 101.09,48.97 85.45,33.33 85.45,30.28 84.73,29.57 v55.17,29.57 | 9.14,46.84 J27.P$1 | J27.P$2
  Top 0.61: J27.P$2 9.14,46.84
  Bottom 0.203: v128.83,102.62 128.83,101.5 124.77,97.43 122.12,97.43 117.45,92.76 117.45,91.14 103.63,77.32 103.02,77.32 v101.09,75.39 | v55.17,29.57 49.78,29.57 42.88,36.47 29.87,36.47 29.46,36.88 23.06,36.88 16.76,43.18 16.26,43.18 15.24,44.2 15.24,44.7 14.22,45.72 12.7,45.72
  Bottom 0.61: J27.P$2 12.7,45.72
28027_GPIO2
  Top 0.203: U8.5 117.75,103.02 111.05,103.02 110.24,102.21 108.2,102.21 105.46,104.95 105.46,113.59 SV15.16
28027_GPIO3  (via drill 0.51)
  Top 0.203: v116.23,102.21 117.75,102.21 U8.6
  Bottom 0.203: v116.23,102.21 116.23,105.36 108,113.59 SV15.14
28027_GPIO4
  Top 0.203: U8.7 117.75,101.6 116.74,101.6 116.53,101.4 115.93,101.4 115.52,101.8 108,101.8 104.34,105.46 104.34,114.2 104.95,114.81 109.32,114.81 110.44,113.69 SV15.12
28027_GPIO5  (via drill 0.51)
  Top 0.203: v115.21,100.99 117.75,100.99 U8.8 | v113.08,107.39 113.08,113.59 SV15.10
  Bottom 0.203: v115.21,100.99 115.21,105.26 v113.08,107.39
28027_GPIO6
  Top 0.203: U8.9 117.75,100.28 115.62,100.28 115.52,100.18 111.05,100.18 109.83,101.4 107.8,101.4 103.94,105.26 103.94,116.33 104.95,117.35 110.95,117.35 111.96,116.33 111.96,115.72 112.88,114.81 114.4,114.81 115.52,113.69 SV15.8
28027_GPIO7  (via drill 0.51)
  Top 0.203: v119.38,100.38 118.77,99.77 117.86,99.77 U8.10 | v119.38,105.77 119.38,106.17 119.48,106.27 119.48,112.27 118.16,113.59 SV15.6
  Bottom 0.203: v119.38,105.77 v119.38,100.38
28027_GPIO12  (via drill 0.51)
  Top 0.203: v120.19,97.54 119.99,97.74 117.86,97.74 U8.13
  Bottom 0.203: v120.19,97.54 121.01,97.54 121.72,98.25 123.34,98.25 129.24,104.14 130.45,104.14 130.96,104.65 130.96,106.38 124.77,112.57 121.72,112.57 120.7,113.59 SV15.4
28027_GPIO34
  Top 0.203: LED17.C 142.24,88.8 142.34,88.9 R37.1 142.24,88.9 142.24,90.12 134.01,98.35 126.09,98.35 U8.27
28027_SCL  (via drill 0.51)
  Top 0.203: R34.2 132.49,83.41 131.27,82.19 126.39,82.19 123.65,84.94 123.65,91.85 119.08,96.42 117.86,96.42 U8.15 117.75,96.52 116.84,96.52 v116.03,97.33 | v103.43,116.94 104.24,117.75 118.16,117.75 119.69,116.23 120.6,116.23 SV15.3
  Bottom 0.203: v103.43,116.94 103.43,110.44 110.95,102.92 110.95,97.94 111.56,97.33 v116.03,97.33
28027_SDA  (via drill 0.51)
  Top 0.203: v123.65,94.89 121.31,94.89 119.18,97.03 117.86,97.03 U8.14 | v128.42,90.12 130.96,90.12 132.49,88.59 R35.2 | v127,107.29 129.34,104.95 129.34,104.65 v132.18,101.8
  Bottom 0.203: v128.42,90.12 124.46,94.08 | 124.46,94.08 v123.65,94.89 | v127,107.29 121.82,107.29 117.04,112.06 117.04,113.79 116.03,114.81 115.42,114.81 114.5,115.72 114.5,116.74 115.11,117.35 116.03,117.35 117.14,116.23 118.06,116.23 SV15.5 | 124.46,94.08 v132.18,101.8
28027_SPICLKA  (via drill 0.51)
  Top 0.203: v124.36,101.4 124.56,101.6 125.98,101.6 U8.32
  Bottom 0.203: v124.36,101.4 122.12,101.4 116.84,96.11 115.72,96.11 108.41,88.8 108.41,85.55 J38.P$1
28027_SPISIMOA  (via drill 0.51)
  Top 0.203: v129.64,101.8 129.64,102.92 128.93,103.63 128.93,104.75 127.2,106.48 124.87,106.48 124.46,106.07 124.46,104.34 125.17,103.63 125.98,103.63 U8.35 | v118.97,93.07 116.64,93.07 116.53,93.17 110.95,93.17 J36.P$1
  Bottom 0.203: v129.64,101.8 129.24,101.4 129.24,101.3 124.97,97.03 122.33,97.03 118.97,93.67 v118.97,93.07
28027_SPISOMIA  (via drill 0.51)
  Top 0.203: v124.46,103.12 124.56,103.02 125.98,103.02 U8.34
  Bottom 0.203: v124.46,103.12 124.46,102.41 125.17,101.7 125.17,101.09 122.73,98.65 119.99,98.65 117.04,95.71 115.93,95.71 108.81,88.59 108.81,84.43 107.7,83.31 106.88,83.31 106.17,84.02 106.17,85.85 J35.P$1
28027_SPISTEA  (via drill 0.51)
  Top 0.203: v123.65,102.31 125.98,102.31 U8.33
  Bottom 0.203: v123.65,102.31 122.43,102.31 116.64,96.52 111.76,96.52 J37.P$1
+5V  (via drill 0.51)
  Top 0.61: L1.P$61 49.58,102.31 52.02,102.31 J152.P$1 52.32,102.31 54.56,102.31 J152.P$2 54.86,102.31 57.1,102.31 J152.P$3 | L1.P$21 49.58,165.81 52.02,165.81 J103.P$1 52.32,165.81 54.56,165.81 J103.P$2 54.86,165.81 57.1,165.81 J103.P$3 | J200.P$1 J200.P$2 17.27,159.82 18.49,158.6 18.49,151.89 | 18.49,151.89 17.27,150.67 17.27,150.06 J203.P$2 J203.P$1 14.43,149.66 14.43,142.04 9.86,137.47 DCDC5V.3 | SV2.4 3.15,53.95 3.15,51.51 SV2.2 3.45,51.51 5.69,51.51 SV2.1 5.69,51.82 5.69,53.95 SV2.3 | R26.2 2.23,120.7 2.23,123.65 2.03,123.85 S17.P$5 | S17.P$5 1.93,124.16 1.93,126.39 S18.P$5 2.23,126.49 4.47,126.49 S18.P$4 | S17.P$5 2.44,123.85 4.47,123.85 S17.P$4 4.78,123.95 7.01,123.95 S17.P$3 | S18.P$3 7.01,126.39 7.01,124.26 S17.P$3 | S17.P$2 9.55,123.95 7.32,123.95 S17.P$3 | S18.P$2 9.55,126.39 9.55,124.26 S17.P$2 | S17.P$1 12.09,123.95 9.86,123.95 S17.P$2 | v44.2,133.81 37.69,133.81 19.81,151.69 18.69,151.69 18.49,151.89
  Bottom 0.61: 48.26,133.81 48.26,164.49 49.48,165.71 L1.P$21 | 48.26,133.81 48.26,121.92 49.48,120.7 49.48,102.31 L1.P$61 | DCDC5V.3 9.75,137.36 9.75,126.59 9.65,126.49 S18.P$2 9.96,126.49 12.09,126.49 S18.P$1 | SV2.4 3.15,54.05 3.15,54.66 1.83,55.98 1.83,100.18 4.98,103.33 15.85,103.33 17.78,105.26 17.78,122.33 16.26,123.85 12.19,123.85 S17.P$1 | v44.2,133.81 48.26,133.81
A4973EN
  Top 0.203: 49.28,19.3 36.88,31.7 36.88,55.47 38.56,57.15 | 38.56,57.15 38.61,57.2 39.83,57.2 U5.8 | U1.8 23.37,57.3 23.37,62.69 26.42,65.73 32.31,65.73 38.51,59.54 38.51,57.2 38.56,57.15
  Top 0.61: 49.28,19.3 S1.P$2
ADCA0  (via drill 0.51)
  Top 0.203: v133.1,94.28 132.89,94.49 126.09,94.49 U8.21
  Bottom 0.203: v133.1,94.28 135.84,94.28 135.94,94.18 139.6,94.18 143.87,98.45 143.87,106.88 142.04,108.71 141.53,108.71 140.51,109.73 140.51,110.24 139.5,111.25 138.99,111.25 138.18,112.06 138.18,113.59 136.65,115.11 116.64,115.11 115.62,116.13 SV15.7
ADCA2  (via drill 0.51)
  Top 0.203: v127.61,93.67 127.51,93.78 126.09,93.78 U8.20 | v127.71,108.51 v133.3,102.92 | v118.06,112.17 116.64,113.59 116.64,114.2 115.72,115.11 114.71,115.11 113.69,116.13 113.08,116.13 SV15.9
  Bottom 0.203: v127.61,93.67 127.61,95 134.11,101.5 134.11,102.11 v133.3,102.92 | v127.71,108.51 121.72,108.51 v118.06,112.17
ADCA4  (via drill 0.51)
  Top 0.203: v111.76,98.25 116.13,93.88 117.75,93.88 U8.19
  Bottom 0.203: v111.76,98.25 111.76,108.31 106.88,113.18 106.88,115.11 107.9,116.13 SV15.13
ADCA6
  Top 0.203: U8.18 117.86,94.49 118.67,94.49 123.24,89.92 123.24,84.73 126.19,81.79 135.53,81.79 138.48,84.73 142.75,84.73 144.27,86.26 144.27,114.3 141.22,117.35 122.33,117.35 122.12,117.14 122.12,114.71 123.14,113.69 SV15.2
ADCB2  (via drill 0.51)
  Top 0.203: v122.02,104.24 122.02,99.57 125.07,96.52 125.98,96.52 U8.24
  Bottom 0.203: v122.02,104.24 113.69,112.57 112.57,112.57 111.56,113.59 111.56,115.11 110.54,116.13 SV15.11
ADCB4  (via drill 0.51)
  Top 0.203: v128.63,97.13 126.09,97.13 U8.25 | v130.15,104.95 v133.3,101.8
  Bottom 0.203: v133.3,101.8 v128.63,97.13 | v130.15,104.95 122.73,104.95 114.1,113.59 114.1,114.2 113.18,115.11 112.57,115.11 111.56,116.13 111.56,116.74 110.95,117.35 106.58,117.35 105.46,116.23 SV15.15
ADCIN14
  Top 0.203: 49.58,160.73 L1.P$23 | 52.02,160.73 J105.P$1 52.12,160.73 | 54.66,160.73 J105.P$2 54.56,160.73 | 57.1,160.73 J105.P$3
  Top 0.61: 52.02,160.73 49.58,160.73 | 57.1,160.73 54.66,160.73 | 54.56,160.73 52.12,160.73
ADCIN15
  Top 0.203: 49.58,97.23 L1.P$63 | 52.02,97.23 J150.P$1 52.12,97.23 | 54.66,97.23 J150.P$2 54.56,97.23 | 57.1,97.23 J150.P$3
  Top 0.61: 52.02,97.23 49.58,97.23 | 57.1,97.23 54.66,97.23 | 54.56,97.23 52.12,97.23
ADCINA2  (via drill 0.51)
  Top 0.203: 49.58,145.49 L1.P$29 | 52.02,145.49 J111.P$1 52.12,145.49 | 54.66,145.49 J111.P$2 54.56,145.49 | 57.1,145.49 J111.P$3 | v141.83,147.42 141.43,147.42 140,146 139.5,146 138.18,144.68 138.18,144.27 132.59,138.68 132.59,135.94 131.98,135.33 119.28,135.33 v115.52,131.57
  Top 0.61: 52.02,145.49 49.58,145.49 | 57.1,145.49 54.66,145.49 | 54.56,145.49 52.12,145.49
  Bottom 0.203: v141.83,147.42 141.83,150.67 151.18,160.02 152.2,160.02 153.11,160.93 153.11,161.85 152.09,162.87 152.09,163.88 SV11.3 | v115.52,131.57 98.86,131.57 96.72,129.44 84.84,129.44 79.96,134.31 74.57,134.31 63.5,145.39 57.2,145.39 J111.P$3
ADCINA3
  Top 0.203: 49.58,153.11 L1.P$26 | 52.02,153.11 J108.P$1 52.12,153.11 | 54.66,153.11 J108.P$2 54.56,153.11 | 57.1,153.11 J108.P$3
  Top 0.61: 52.02,153.11 49.58,153.11 | 57.1,153.11 54.66,153.11 | 54.56,153.11 52.12,153.11
  Bottom 0.203: SV11.4 152.09,166.42 152.09,165.41 153.52,163.98 153.52,139.09 136.14,121.72 101.4,121.72 94.08,129.03 84.63,129.03 79.76,133.91 74.37,133.91 64.01,144.27 56.69,144.27 56.08,144.88 56.08,151.99 57.1,153.01 J108.P$3
ADCINA4
  Top 0.203: 49.58,81.99 L1.P$69 | 52.02,81.99 J144.P$1 52.12,81.99 | 54.66,81.99 J144.P$2 54.56,81.99 | 57.1,81.99 J144.P$3
  Top 0.61: 52.02,81.99 49.58,81.99 | 57.1,81.99 54.66,81.99 | 54.56,81.99 52.12,81.99
ADCINA5
  Top 0.203: 49.58,89.61 L1.P$66 | 52.02,89.61 J147.P$1 52.12,89.61 | 54.66,89.61 J147.P$2 54.56,89.61 | 57.1,89.61 J147.P$3
  Top 0.61: 52.02,89.61 49.58,89.61 | 57.1,89.61 54.66,89.61 | 54.56,89.61 52.12,89.61
ADCINB2
  Top 0.203: 49.58,148.03 L1.P$28 | 52.02,148.03 J110.P$1 52.12,148.03 | 54.66,148.03 J110.P$2 54.56,148.03 | 57.1,148.03 J110.P$3
  Top 0.61: 52.02,148.03 49.58,148.03 | 57.1,148.03 54.66,148.03 | 54.56,148.03 52.12,148.03
ADCINB3
  Top 0.203: 49.58,155.65 L1.P$25 | 52.02,155.65 J107.P$1 52.12,155.65 | 54.66,155.65 J107.P$2 54.56,155.65 | 57.1,155.65 J107.P$3
  Top 0.61: 52.02,155.65 49.58,155.65 | 57.1,155.65 54.66,155.65 | 54.56,155.65 52.12,155.65
ADCINB4  (via drill 0.51)
  Top 0.203: 49.58,84.53 L1.P$68 | 52.02,84.53 J145.P$1 52.12,84.53 | 54.66,84.53 J145.P$2 54.56,84.53 | 57.1,84.53 J145.P$3 | v95.5,112.37 101.7,112.37 SV12.4
  Top 0.61: 52.02,84.53 49.58,84.53 | 57.1,84.53 54.66,84.53 | 54.56,84.53 52.12,84.53
  Bottom 0.203: v95.5,112.37 86.46,103.33 76,103.33 57.2,84.53 J145.P$3
ADCINB5
  Top 0.203: 49.58,92.15 L1.P$65 | 52.02,92.15 J148.P$1 52.12,92.15 | 54.66,92.15 J148.P$2 54.56,92.15 | 57.1,92.15 J148.P$3
  Top 0.61: 52.02,92.15 49.58,92.15 | 57.1,92.15 54.66,92.15 | 54.56,92.15 52.12,92.15
ADCINC2
  Top 0.203: 49.58,150.57 L1.P$27 | 52.02,150.57 J109.P$1 52.12,150.57 | 54.66,150.57 J109.P$2 54.56,150.57 | 57.1,150.57 J109.P$3
  Top 0.61: 52.02,150.57 49.58,150.57 | 57.1,150.57 54.66,150.57 | 54.56,150.57 52.12,150.57
ADCINC3
  Top 0.203: 49.58,158.19 L1.P$24 | 52.02,158.19 J106.P$1 52.12,158.19 | 54.66,158.19 J106.P$2 54.56,158.19 | 57.1,158.19 J106.P$3
  Top 0.61: 52.02,158.19 49.58,158.19 | 57.1,158.19 54.66,158.19 | 54.56,158.19 52.12,158.19
ADCINC4
  Top 0.203: 49.58,87.07 L1.P$67 | 52.02,87.07 J146.P$1 52.12,87.07 | 54.66,87.07 J146.P$2 54.56,87.07 | 57.1,87.07 J146.P$3
  Top 0.61: 52.02,87.07 49.58,87.07 | 57.1,87.07 54.66,87.07 | 54.56,87.07 52.12,87.07
ADCINC5
  Top 0.203: 54.66,94.69 J149.P$2 54.56,94.69 | 57.1,94.69 J149.P$3 | 52.12,94.69 J149.P$1
  Top 0.61: 57.1,94.69 54.66,94.69 | 54.56,94.69 52.12,94.69
  Bottom 0.203: L1.P$64 49.58,94.69 52.02,94.69 J149.P$1
DACOUTA
  Top 0.203: 49.58,142.95 L1.P$30 | 52.02,142.95 J112.P$1 52.12,142.95 | 54.66,142.95 J112.P$2 54.56,142.95 | 57.1,142.95 J112.P$3
  Top 0.61: 52.02,142.95 49.58,142.95 | 57.1,142.95 54.66,142.95 | 54.56,142.95 52.12,142.95
DACOUTB
  Top 0.203: 49.58,79.45 L1.P$70 | 52.02,79.45 J143.P$1 52.12,79.45 | 54.66,79.45 J143.P$2 54.56,79.45 | 57.1,79.45 J143.P$3
  Top 0.61: 52.02,79.45 49.58,79.45 | 57.1,79.45 54.66,79.45 | 54.56,79.45 52.12,79.45
DRV1_DIR  (via drill 0.51)
  Top 0.203: v100.38,8.64 100.99,9.25 100.99,10.57 U2.P$2 | 92.56,27.43 v101.8,27.43 | 89.41,30.58 J80.P$2 89.31,30.68 | 86.87,30.68 J80.P$1
  Top 0.61: 89.41,30.58 92.56,27.43 | 89.31,30.68 86.87,30.68
  Bottom 0.203: v100.38,8.64 100.38,26.01 v101.8,27.43
DRV1_M+
  Top 0.356: U2.P$8 104.99,9.31 105.41,9.53
  Top 0.762: 105.41,9.53 105.41,9.68
  Top 1.016: 105.41,9.68 114.46,9.68 SV7.1 SV7.3 SV7.5
DRV1_M-
  Top 0.356: U2.P$10 104.34,19.25 104.62,19.53
  Top 1.016: 104.62,19.53 107.63,19.37 110.49,16.51 SV7.6 SV7.4 SV7.2
DRV1_PWM  (via drill 0.51)
  Top 0.203: v95.91,11.68 96.93,10.67 100.38,10.67 U2.P$1 | 89.41,33.12 J79.P$2 89.31,33.22 | 86.87,33.22 J79.P$1
  Top 0.61: 89.41,33.12 v91.75,30.79 | 89.31,33.22 86.87,33.22
  Bottom 0.203: v95.91,11.68 95.91,13.11 96.11,13.31 96.11,26.42 v91.75,30.79
DRV2_DIR  (via drill 0.51)
  Top 0.203: v66.34,10.67 68.07,8.94 68.68,8.94 68.99,9.25 68.99,10.57 U4.P$2 | 63.4,30.68 J83.P$1 | 65.84,30.68 J83.P$2
  Top 0.61: 65.84,30.68 63.4,30.68
  Bottom 0.203: 66.34,30.18 v66.34,10.67
  Bottom 0.61: J83.P$2 66.34,30.18
DRV2_M+
  Top 0.356: U4.P$8 72.92,9.47 73.34,9.37
  Top 1.016: 73.34,9.37 82.55,9.37 82.55,11.27 SV8.1 SV8.3 SV8.5
DRV2_M-
  Top 0.356: U4.P$10 72.27,19.09 72.71,19.53
  Top 1.016: 72.71,19.53 76.83,19.53 SV8.6 SV8.4 SV8.2
DRV2_PWM  (via drill 0.51)
  Top 0.203: v65.53,11.48 66.65,11.48 67.46,10.67 68.28,10.67 U4.P$1
  Bottom 0.203: v65.53,11.48 65.53,29.46 64.72,30.28 64.72,32 64.77,32.05 | 65.84,33.12 J82.P$2 | 63.4,33.12 J82.P$1
  Bottom 0.61: 65.84,33.12 64.77,32.05 63.7,33.12 63.4,33.12
GND  (via drill 0.51)
  Top 0.356: U2.P$16 100.44,13.97 U2.P$17 | U2.P$15 101.09,13.97 U2.P$17 | U2.P$9 104.99,13.97 U2.P$17 | U2.P$7 104.34,13.97 U2.P$17 | U4.P$16 68.37,14.18 68.58,13.97 | U4.P$15 69.02,14.17 69.22,13.97 | U4.P$9 72.92,14.08 73.03,13.97 | U4.P$7 72.27,13.93 72.23,13.97 | U8.23 124.66,95.8 121.1,95.8 121.1,98.39 | 121.1,98.39 121.1,104.25 | 121.1,104.25 121.1,104.89 | 121.1,104.89 C11.2 | U8.12 121.1,98.39 | U8.2 121.1,104.89 | U8.3 121.1,104.25
  Top 0.406: 116.74,104.85 117.65,104.85 U8.2
  Top 0.61: 11.89,179.63 7.82,179.63 6.1,177.9 6.1,177.09 6.91,176.28 12.09,176.28 12.29,176.48 U3.4 | 11.89,179.63 12.8,179.63 C21.2 | 10.77,194.36 7.32,194.36 T1.3 | 10.77,194.36 12.9,196.49 16.56,196.49 18.49,194.56 18.49,194.36 T2.3 18.8,194.16 26.72,194.16 27.53,193.34 | 11.89,179.63 11.89,193.24 10.77,194.36 | v45.72,187.35 48.97,187.35 U7.4 | 27.53,193.34 27.53,191.31 28.35,190.5 28.35,180.75 G1.- | 27.53,193.34 28.75,194.56 SV13.2 28.85,194.87 30.07,196.09 36.98,196.09 38.61,194.46 52.53,194.46 C4.2 52.83,194.56 53.03,194.56 54.36,195.88 58.52,195.88 75.69,178.71 | L1.P$22 49.58,163.27 52.02,163.27 J104.P$1 52.32,163.27 54.56,163.27 J104.P$2 54.86,163.27 57.1,163.27 J104.P$3 57.4,163.27 60.25,163.27 75.69,178.71 | 92.15,182.88 92.15,184.2 93.98,186.03 93.98,188.37 92.35,189.99 92.15,189.99 C6.2 91.85,190.19 91.24,190.81 v91.24,192.02 | 92.15,182.88 92.15,177.39 C9.2 | 92.15,182.88 84.33,182.88 82.6,181.15 82.6,180.24 IC2.7 82.3,180.14 77.11,180.14 75.69,178.71 | v83.21,191.31 82.6,191.92 82.6,192.94 IC1.7 | C10.2 91.44,129.54 v90.42,130.56 | v82.6,133.6 81.99,132.99 81.99,131.98 IC3.7 81.89,131.78 81.89,130.35 75.29,123.75 64.21,123.75 B2.P$2 | L1.P$62 49.58,99.77 52.02,99.77 J151.P$1 52.32,99.77 54.56,99.77 J151.P$2 54.86,99.77 57.1,99.77 J151.P$3 | J102.P$3 100.28,165.81 97.84,165.81 J102.P$2 | J7.P$1 118.97,172.11 118.97,174.55 J7.P$2 | v147.32,131.78 ETH1.P$1 ETH1.P$2 | v142.54,136.96 139.5,133.91 131.47,133.91 SV6.4 | SV11.1 151.99,158.9 151.99,159.61 150.47,161.14 150.47,179.93 U$9.P$2 150.27,180.24 147.83,180.24 U$9.P$1 147.83,180.54 147.83,185.01 U$8.P$1
  Top 0.61: 126.49,190.7 B1.P$2 126.69,190.91 127.61,191.82 147.83,191.82 | R7.1 43.59,63.4 43.59,60.96 C2.2 43.59,60.66 43.59,57.3 U5.5 | U5.4 44.91,57.3 43.89,57.3 U5.5 | 39.83,52.02 38,52.02 JP3.2 | 39.83,52.02 42.37,49.48 42.37,48.16 U5.11 | U5.11 42.67,48.06 43.59,48.06 U5.12 43.89,48.06 44.91,48.06 U5.13 | C1.- 42.27,38.81 42.27,43.18 42.16,43.28 42.16,47.95 U5.11 | 39.83,52.02 43.59,55.78 43.59,57 U5.5 | R3.1 27.64,63.4 27.64,60.96 C14.2 27.64,60.66 27.64,57.71 | 27.64,57.71 27.23,57.3 U1.5 27.03,57 27.03,55.78 23.27,52.02 | U1.4 28.35,57.3 28.04,57.3 27.64,57.71 | SV4.10 8.33,61.67 10.77,61.67 SV4.9 10.77,61.98 10.77,62.28 12.09,63.6 12.09,80.57 10.97,81.69 SV4.25 10.77,81.99 8.33,81.99 SV4.26 | 23.27,52.02 21.44,52.02 JP2.2 | 23.27,52.02 25.81,49.48 25.81,48.16 U1.11 | U1.11 26.11,48.06 27.13,48.06 U1.12 27.43,48.06 28.35,48.06 U1.13 | C13.- 25.81,38.81 25.81,43.89 26.11,44.2 26.11,47.75 U1.11 | 27.43,109.63 28.85,111.05 28.85,116.53 C3.2 | 27.43,109.63 26.62,109.63 U6.P$4 | 27.43,109.63 27.64,109.42 27.64,107.09 31.9,102.82 31.9,92.25 26.31,86.67 B3.P$1 | S129.P$5 S129.P$4 S129.P$3 S129.P$2 S129.P$1 | SV2.30 3.25,87.07 5.69,87.07 SV2.29 | SV2.34 3.25,92.15 5.69,92.15 SV2.33 | SV2.30 3.05,87.27 3.05,87.78 1.83,89 1.83,90.63 3.05,91.85 SV2.34 | SV2.20 3.25,74.37 5.69,74.37 SV2.19 | SV2.5 5.69,56.59 3.25,56.59 SV2.6 3.05,56.79 3.05,57.3 1.83,58.52 1.83,65.23 3.05,66.45 SV2.14 | SV2.14 3.25,66.75 5.69,66.75 SV2.13 | SV2.20 3.05,74.07 3.05,73.46 1.83,72.24 1.83,68.17 3.05,66.95 SV2.14 | SV2.30 2.95,86.77 2.95,86.06 1.83,84.94 1.83,75.79 3.05,74.57 SV2.20 | SV4.39 10.77,99.77 8.33,99.77 SV4.40 8.13,99.97 8.13,104.34 7.01,105.46
  Top 0.61: 7.01,105.46 4.67,105.46 POWER.1 4.47,105.16 1.83,102.51 1.83,94.08 3.05,92.86 3.05,92.35 SV2.34 | 7.01,105.46 8.94,107.39 J5.2 8.94,107.7 8.94,109.22 6.4,111.76 J5.3 5.99,111.96 6.2,111.96 11.99,117.75 13.01,117.75 5V.C 13.31,120.5 3V3.C 13.41,120.8 13.41,127 12.6,127.81 11.99,127.81 3.35,136.45 3.35,138.38 3.66,138.68 7.21,138.68 | S137.P$5 S137.P$4 S137.P$3 | 7.21,138.68 7.21,147.22 S137.P$3 | 7.21,138.68 7.21,137.47 DCDC5V.2 | S137.P$3 S137.P$2 S137.P$1 | v22.66,141.53 26.72,137.47 27.03,137.47 DCDC3.3V.2 | S159.P$1 55.27,4.27 60.86,4.27 62.38,2.74 TRIMPOT2.5 62.69,2.74 64.92,2.74 TRIMPOT2.6 | S1.P$1 51.82,11.79 55.78,11.79 56.9,12.9 v58.42,13.81 | C25.- 61.98,14.12 C28.- | J124.P$1 81.28,62.48 83.82,62.48 J124.P$2 84.02,62.48 86.36,62.48 J124.P$3 86.56,62.48 88.9,62.48 U$1.2 | TRIMPOT1.6 TRIMPOT1.5 94.08,2.74 94.08,3.45 92.96,4.57 92.96,14.05 | C22.2 76.1,21.54 78.03,21.54 81.79,17.78 87.07,17.78 89.92,14.94 v91.44,13.97 90.02,12.9 80.67,3.56 R43.2 | v108.71,20.02 108.1,20.62 108.1,21.54 C16.2 108.41,21.54 110.44,21.54 118.06,29.16 135.03,29.16 136.25,30.38 S20.P$1 136.55,30.48 137.16,31.09 | v107.8,8.43 112.67,3.56 R41.2 | SV19.1 148.03,59.74 150.47,59.74 SV17.1 150.77,59.74 153.01,59.74 SV17.2 | 137.16,31.09 141.73,31.09 LED18.C | 137.16,31.09 136.55,31.7 136.55,33.02 S20.P$2 136.55,33.22 136.55,35.56 S20.P$3 136.55,35.76 136.55,38.1 S20.P$4 136.55,38.3 136.55,40.64 S20.P$5 136.55,40.84 136.55,43.18 S20.P$6 136.55,43.38 136.55,45.72 S20.P$7 136.55,45.92 136.55,48.26 S20.P$8 136.55,48.46 136.55,50.8 S20.P$9 136.55,51 136.55,53.34 S20.P$10 136.55,53.54 136.55,55.88 S24.P$1 136.55,56.08 136.55,58.42 S24.P$2 136.55,58.62 136.55,60.96 S24.P$3 136.55,61.16 136.55,63.5 S24.P$4 136.55,63.7 136.55,66.04 S24.P$5 136.55,66.24 136.55,68.58 S24.P$6 136.55,68.78 136.55,71.12 S24.P$7 136.55,71.32 136.55,73.66 S24.P$8 136.55,73.86 136.55,76.2 S24.P$9 136.55,76.4 136.55,77.22
  Top 0.61: 136.55,77.22 136.55,78.74 S24.P$10 | 136.55,77.22 144.07,77.22 P2.2 | L1.P$60 92.76,102.31 95.2,102.31 J153.P$1 95.5,102.31 97.54,102.31 J153.P$2 97.84,102.31 100.08,102.31 J153.P$3 | C8.2 105.56,97.03 100.38,102.21 J153.P$3 | SV12.1 101.7,104.75 101.7,103.53 100.58,102.41 J153.P$3 | v138.18,98.15 139.8,96.52 C5.2 | SV14.8 139.4,107.39 139.4,109.83 SV14.10 139.4,110.13 139.4,112.06 SV14.12 139.29,112.37 139.19,112.27 135.64,112.27 R32.2 135.33,112.27 124.46,112.27 | 116.74,104.85 115.42,106.17 C18.2 109.02,105.97 v107.9,104.85 | 125.48,92.66 134.62,92.66 C7.2 | 125.48,92.66 124.66,93.47 124.66,95.8 | 124.46,112.27 124.46,110.64 121.21,107.39 C11.2 | 124.46,112.27 124.46,114.2 123.24,115.42 123.24,116.13 SV15.1 | 125.48,92.66 124.87,92.05 124.87,85.45 P1.2 | U$6.P$2 150.27,195.48 147.83,195.48 U$6.P$1 147.83,195.17 147.83,191.82 | U$7.P$1 147.83,190.4 150.27,190.4 U$7.P$2 | U$8.P$1 147.83,185.32 150.27,185.32 U$8.P$2 | U$7.P$1 147.83,190.09 147.83,185.62 U$8.P$1 | 147.83,191.82 147.83,190.7 U$7.P$1
  Top 3.302: C20.- 104.9,14.05 104.99,13.97
  Top 3.556: v91.44,13.97 91.52,14.05 92.96,14.05 C20.- | v58.42,13.81 58.42,13.89 C28.- 61.91,13.97 68.58,13.97 69.22,13.97 U4.P$17 72.23,13.97 73.03,13.97
  Bottom 0.61: v45.72,187.35 36.98,196.09 30.07,196.09 28.85,194.87 SV13.2 | v83.21,191.31 86.26,191.31 87.17,192.23 91.03,192.23 v91.24,192.02 91.44,191.82 91.95,191.82 99.87,183.9 99.87,167.94 97.94,166.01 J102.P$2 97.74,165.81 95.5,165.81 J102.P$1 95.2,165.81 92.76,165.81 L1.P$20 | v82.6,133.6 85.65,130.56 v90.42,130.56 90.63,130.35 95.3,130.35 95.61,130.05 96.42,130.05 98.96,132.59 127.41,132.59 128.63,133.81 SV6.3 128.93,133.91 131.37,133.91 SV6.4 | J151.P$3 57.2,99.77 57.2,100.48 64.11,107.39 64.11,123.65 B2.P$2 | B1.P$2 126.49,182.07 119.08,174.65 J7.P$2 118.77,174.75 117.55,175.97 115.93,175.97 105.77,165.81 100.38,165.81 J102.P$3 | v147.32,131.78 ETH1.P$12 147.12,118.67 147.12,100.69 129.84,83.41 | ETH1.P$2 v142.54,136.96 | ETH1.P$1 147.32,140.31 151.99,144.98 151.99,158.8 SV11.1 | 42.27,41.86 42.27,47.75 38,52.02 JP3.2 37.69,52.22 23.88,52.22 22.66,53.44 | 42.27,41.86 42.27,38.91 C15.- | C12.- 25.7,38.91 25.7,40.74 21.44,45.01 21.44,52.02 JP2.2 21.54,52.32 22.66,53.44 | 22.66,53.44 22.66,55.58 16.66,61.57 10.87,61.57 SV4.9 | 12.09,81.99 21.64,81.99 26.21,86.56 B3.P$1 | 12.09,81.99 10.87,81.99 SV4.25 | S129.P$1 14.02,157.48 27.03,144.47 27.03,137.47 DCDC3.3V.2 | v22.66,141.53 17.88,141.53 12.09,147.32 S137.P$1 | 12.09,81.99 12.09,98.45 10.87,99.67 SV4.39 | S159.P$1 55.17,4.37 55.17,8.33 51.82,11.68 S1.P$1 | v108.71,20.02 102.72,14.02 U2.P$17 102.82,13.72 107.8,8.74 v107.8,8.43 | U$1.2 89,62.38 89,61.67 90.73,59.94 90.73,15.54 v91.44,13.97 89.92,14.94 89.61,15.24 79.25,15.24 78.03,14.02 70.71,14.02 U4.P$17 | J43.P$1 152.71,86.67 152.71,85.75 144.17,77.22 P2.2 144.27,76.91 151.49,69.7 151.49,65.84 150.57,64.92 150.57,59.74 SV17.1
  Bottom 0.61: v138.18,98.15 138.18,99.06 138.07,99.16 138.07,100.99 139.29,102.21 SV14.4 139.29,102.51 139.29,103.02 138.07,104.24 138.07,106.07 139.29,107.29 SV14.8 | v107.9,104.85 107.7,104.65 105.87,104.65 105.77,104.75 101.8,104.75 SV12.1 | S24.P$10 134.52,78.74 129.84,83.41 | 129.84,83.41 127.91,85.34 124.87,85.34 P1.2 | 42.27,41.86 49.58,41.86 56.9,34.54 56.9,15.95 57.51,15.34 v58.42,13.81
  Bottom 3.556: C27.- 93.91,13.97 v91.44,13.97 | v58.42,13.81 61.91,13.81 C28.-
  pour Bottom: 0,198.12 154.94,198.12 154.94,27.3 115.57,27.3 115.57,26.67 115.57,0 39.37,0 39.37,27.3 0,27.3
  pour Top: 0,198.12 154.94,198.12 154.94,27.3 115.57,27.3 115.57,0 39.37,0 39.37,27.3 0,27.3
GPIO0  (via drill 0.51)
  Top 0.203: 134.01,128.83 J11.P$1 | 136.45,128.83 J11.P$2 | 82.6,165.81 J122.P$1 | 85.04,165.81 J122.P$2 85.14,165.81 | 87.58,165.81 J122.P$3 | v122.33,166.73 120.4,166.73 118.57,164.9 102.72,164.9 100.79,166.83 v96.22,166.83
  Top 0.61: 136.45,128.83 134.01,128.83 | 85.04,165.81 82.6,165.81 | 87.58,165.81 85.14,165.81
  Bottom 0.203: 87.68,165.81 J122.P$3 | 90.12,165.81 L1.P$40 90.22,165.81 | v122.33,166.73 138.89,150.16 138.89,149.25 138.58,148.95 138.58,136.25 136.55,134.21 136.55,128.83 J11.P$2 | 91.24,166.83 v96.22,166.83
  Bottom 0.61: 90.12,165.81 87.68,165.81 | 90.22,165.81 91.24,166.83
GPIO1
  Top 0.203: 82.6,163.27 J121.P$1 | 85.04,163.27 J121.P$2 85.14,163.27 | 87.58,163.27 J121.P$3
  Top 0.61: 85.04,163.27 82.6,163.27 | 85.14,163.27 87.58,163.27
  Bottom 0.203: 87.68,163.27 J121.P$3 | 90.12,163.27 L1.P$39 | 34.95,192.23 45.52,181.66 51.21,181.66 64.82,168.05 76.81,168.05 81.58,163.27 | 33.93,192.23 SV13.5 | 82.5,163.27 J121.P$1
  Bottom 0.61: 90.12,163.27 87.68,163.27 | 34.95,192.23 33.93,192.23 | 82.5,163.27 81.58,163.27
GPIO2  (via drill 0.51)
  Top 0.203: 87.68,160.73 J120.P$3 87.58,160.73 | 90.12,160.73 L1.P$38 | 9.14,41.76 J198.P$1 | J198.P$2 11.68,41.76 | 82.6,160.73 J120.P$1 | 85.04,160.73 J120.P$2 85.14,160.73 | 11.68,42.88 13.01,44.2 13.01,50.49 22.55,60.05 22.55,63.09 26.82,67.36 28.55,67.36 36.27,75.08 36.27,108.51 v49.68,121.92 | v76.61,159.72 v49.68,132.79
  Top 0.61: 90.12,160.73 87.68,160.73 | J198.P$2 9.14,41.76 | 85.04,160.73 82.6,160.73 | 11.68,42.88 11.68,41.76 | 85.14,160.73 87.58,160.73
  Bottom 0.203: v49.68,132.79 v49.68,121.92 | 81.58,159.72 v76.61,159.72 | 82.5,160.63 J120.P$1
  Bottom 0.61: 82.5,160.63 81.58,159.72
GPIO3  (via drill 0.51)
  Top 0.203: 87.68,158.19 J119.P$3 87.58,158.19 | 90.12,158.19 L1.P$37 | 9.14,44.3 J199.P$1 | J199.P$2 | 82.6,158.19 J119.P$1 | 85.04,158.19 J119.P$2 85.14,158.19 | v37.08,88.49 37.08,106.58 52.32,121.82 53.54,121.82 69.9,138.18 69.9,143.26 v80.97,154.33
  Top 0.61: 90.12,158.19 87.68,158.19 | J199.P$2 9.14,44.3 | 85.04,158.19 82.6,158.19 | 85.14,158.19 87.58,158.19
  Bottom 0.203: 9.14,45.41 10.16,46.43 10.16,50.09 9.65,50.6 9.65,64.52 10.67,65.53 11.38,65.53 27.03,81.18 29.77,81.18 v37.08,88.49 | 80.97,156.57 v80.97,154.33 | 9.14,44.3 J199.P$1 | 82.5,158.09 J119.P$1
  Bottom 0.61: 9.14,45.41 9.14,44.3 | 82.5,158.09 80.97,156.57
GPIO4
  Top 0.203: 82.6,155.65 J118.P$1 | 85.04,155.65 J118.P$2 85.14,155.65 | 87.68,155.65 J118.P$3 87.58,155.65 | 90.12,155.65 L1.P$36 | U$5.P$1 138.48,195.48 140.92,195.48 U$5.P$2
  Top 0.61: 85.04,155.65 82.6,155.65 | 90.12,155.65 87.68,155.65 | 87.58,155.65 85.14,155.65